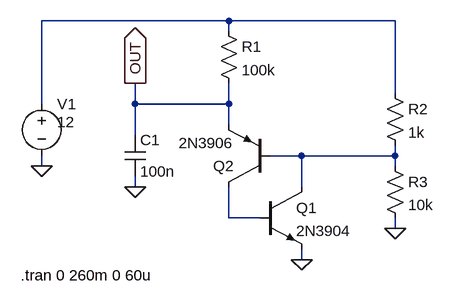
[diagram p0: schematic EXPT 5.asc]
EXPT 5.asc, the LTspice schematic file:
Version 4.1
SHEET 1 880 680
WIRE 224 -96 -64 -96
WIRE 480 -96 224 -96
WIRE 224 -80 224 -96
WIRE 480 16 480 -96
WIRE -64 32 -64 -96
WIRE 80 32 80 0
WIRE 224 32 224 0
WIRE 224 32 80 32
WIRE 224 64 224 32
WIRE 80 80 80 32
WIRE 336 112 288 112
WIRE 480 112 480 96
WIRE 480 112 336 112
WIRE -64 128 -64 112
WIRE 480 128 480 112
WIRE 80 160 80 144
WIRE 336 160 336 112
WIRE 224 208 224 160
WIRE 272 208 224 208
WIRE 480 224 480 208
WIRE 336 272 336 256
FLAG -64 128 0
FLAG 80 160 0
FLAG 336 272 0
FLAG 480 224 0
FLAG 80 0 OUT
IOPIN 80 0 Out
SYMBOL npn 272 160 R0
SYMATTR InstName Q1
SYMATTR Value 2N3904
SYMBOL pnp 288 160 R180
SYMATTR InstName Q2
SYMATTR Value 2N3906
SYMBOL res 208 -96 R0
SYMATTR InstName R1
SYMATTR Value 100k
SYMBOL res 464 0 R0
SYMATTR InstName R2
SYMATTR Value 1k
SYMBOL res 464 112 R0
SYMATTR InstName R3
SYMATTR Value 10k
SYMBOL voltage -64 16 R0
WINDOW 3 24 44 Left 2
WINDOW 123 0 0 Left 0
WINDOW 39 0 0 Left 0
SYMATTR InstName V1
SYMATTR Value 12
SYMBOL cap 64 80 R0
SYMATTR InstName C1
SYMATTR Value 100n
TEXT -96 296 Left 2 !.tran 0 260m 0 60u

The netlist it stands for:
* EXPT 5.asc
Q1 N002 N003 0 0 2N3904
Q2 N003 N002 OUT 0 2N3906
R1 N001 OUT 100k
R2 N001 N002 1k
R3 N002 0 10k
V1 N001 0 12
C1 OUT 0 100n
.model NPN NPN
.model PNP PNP
.lib standard.bjt
.tran 0 260m 0 60u
.backanno
.end